# Altium schematic sheet 01-TABLE OF CONTENTS.SchDoc
size 513 x 386 mm
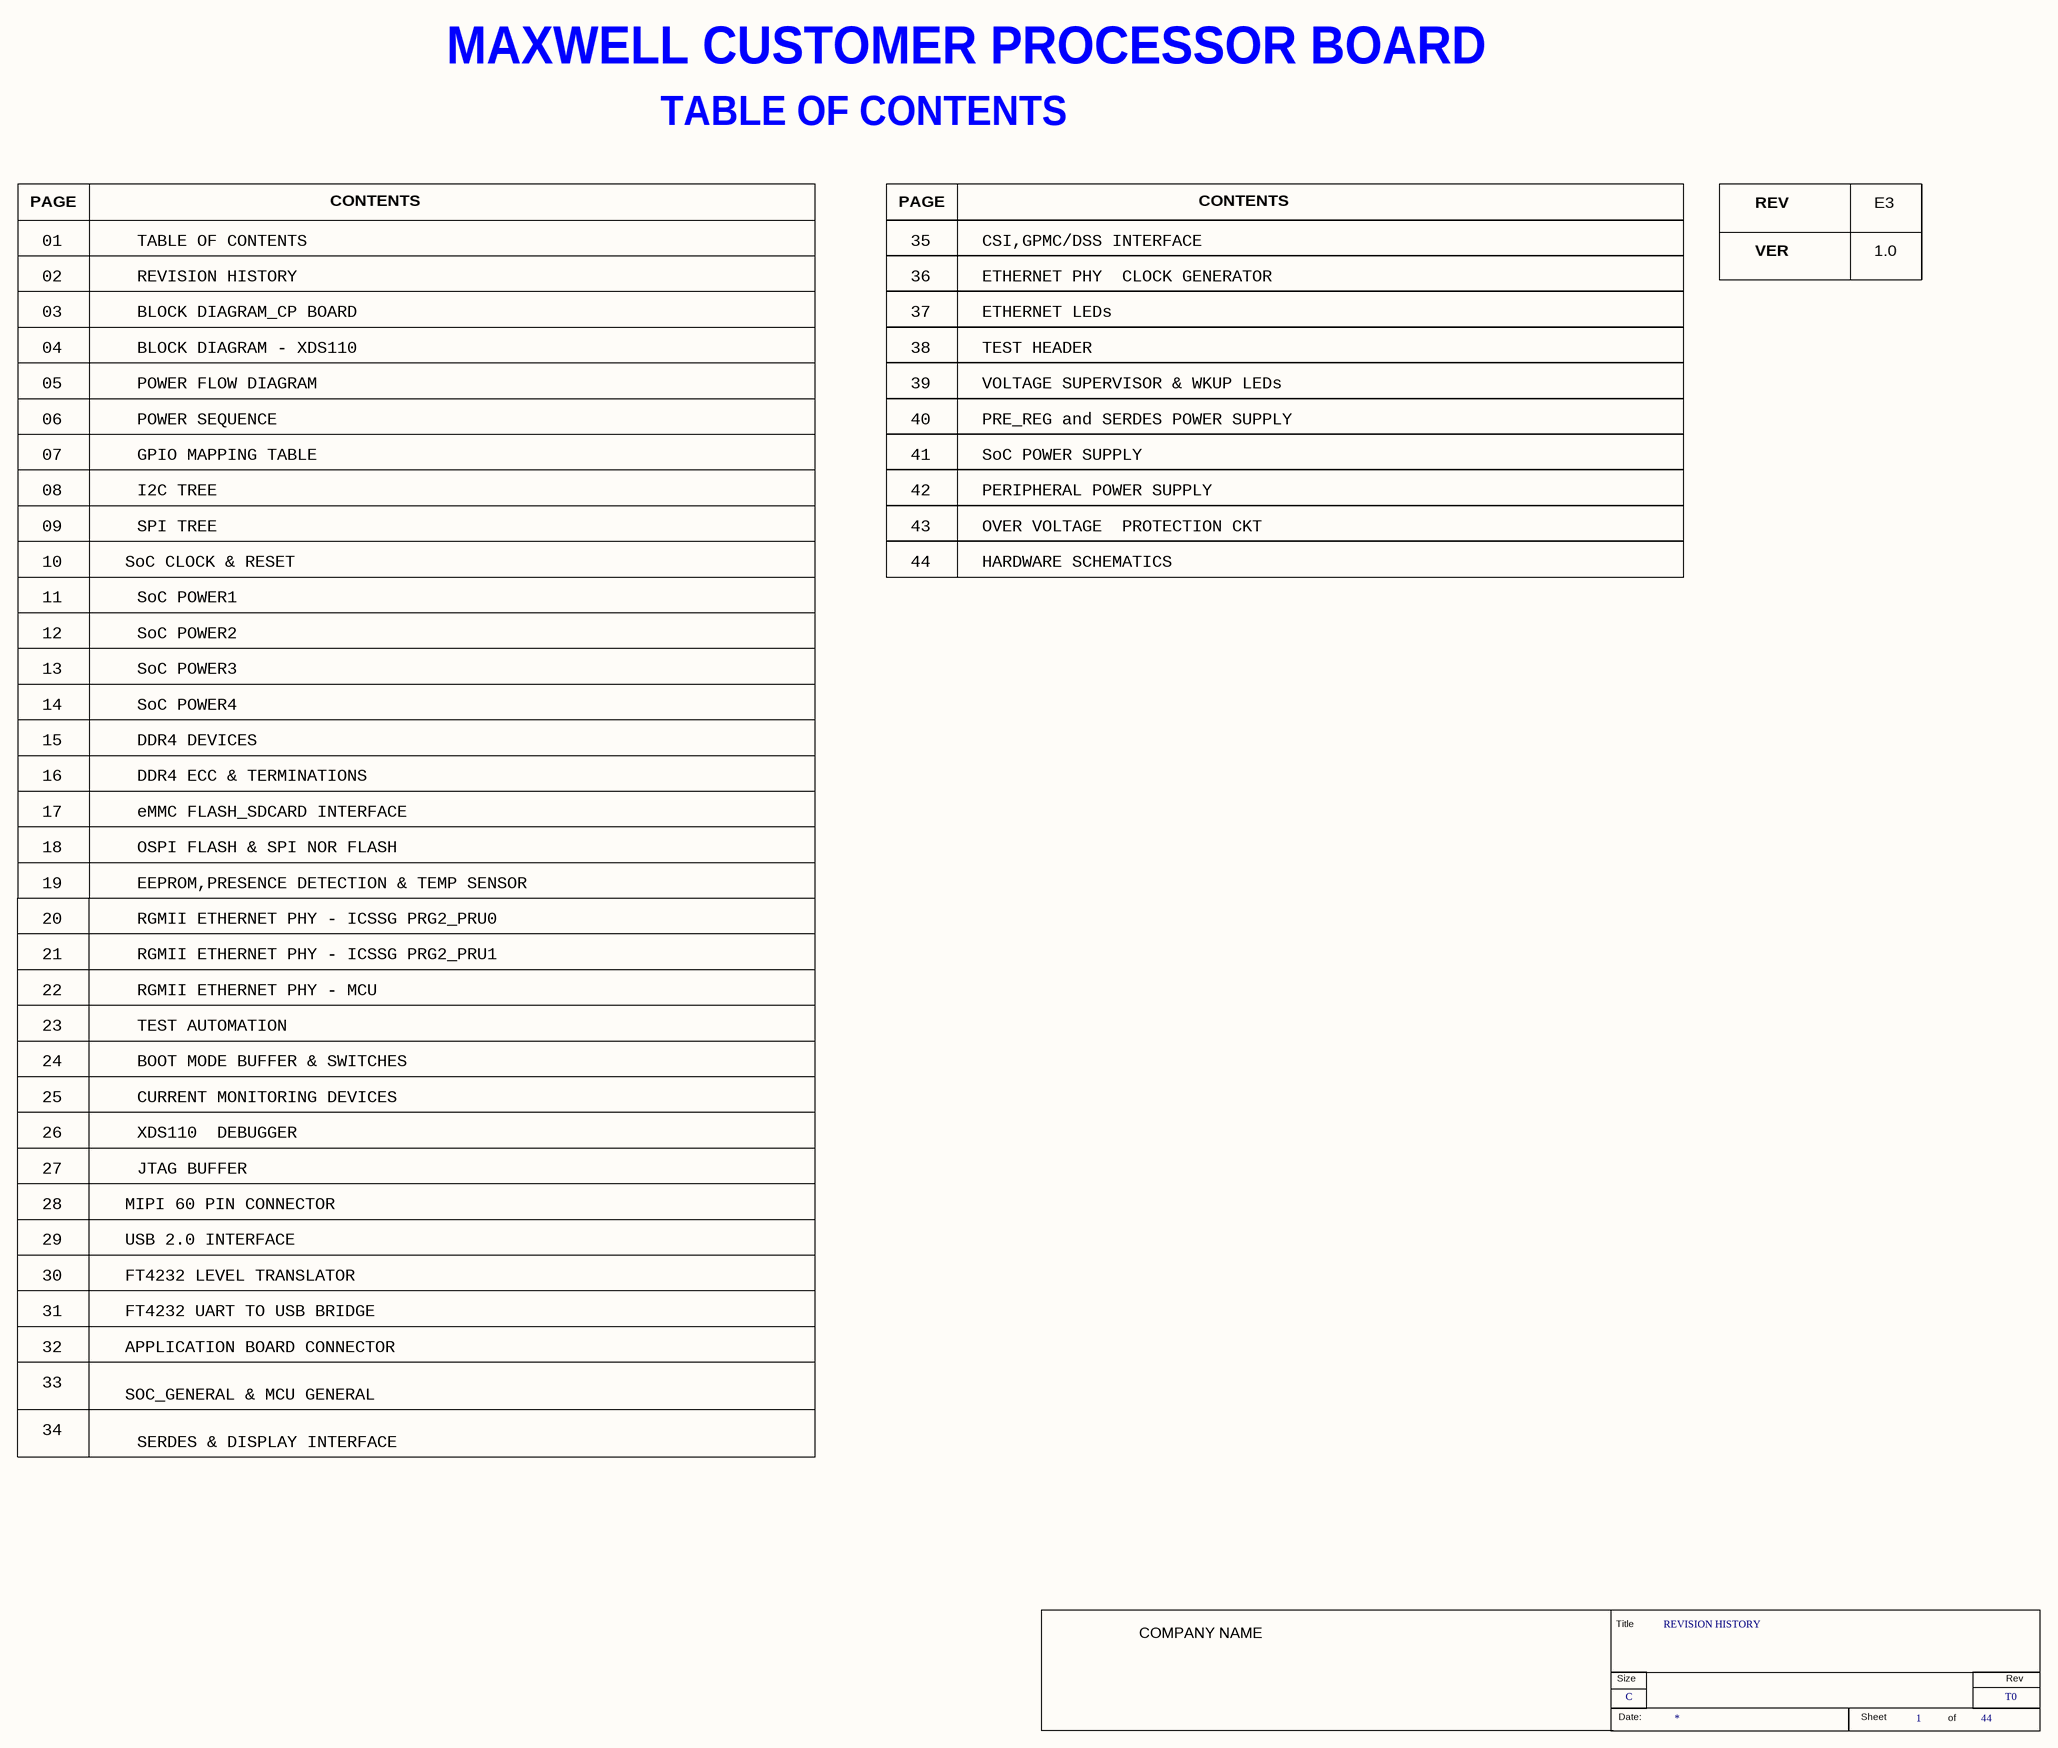
[diagram p0: 01-TABLE OF CONTENTS.SchDoc]

## Parts
*  RevCode: T0  Title: REVISION HISTORY  Page Size: C  Page Number: 1  Page Count: 44  (hidden comment: TRAINING_TITLEBLK_CSIZE)  (graphical)

## Notes on the sheet
- MAXWELL CUSTOMER PROCESSOR BOARD
- TABLE OF CONTENTS
- PAGE
- CONTENTS
- REV
- E3
- 01
- 35
- CSI,GPMC/DSS INTERFACE
- VER
- 1.0
- 02
- 03
- REVISION HISTORY
- BLOCK DIAGRAM_CP BOARD
- 36
- 37
- ETHERNET PHY  CLOCK GENERATOR
- ETHERNET LEDs
- 04
- 05
- BLOCK DIAGRAM - XDS110
- POWER FLOW DIAGRAM
- 38
- 39
- TEST HEADER
- VOLTAGE SUPERVISOR & WKUP LEDs
- 06
- POWER SEQUENCE
- 40
- PRE_REG and SERDES POWER SUPPLY
- 07
- 08
- I2C TREE
- GPIO MAPPING TABLE
- 41
- 42
- SoC POWER SUPPLY
- PERIPHERAL POWER SUPPLY
- 09
- 10
- SoC CLOCK & RESET
- SPI TREE
- 43
- 44
- OVER VOLTAGE  PROTECTION CKT
- HARDWARE SCHEMATICS
- 11
- SoC POWER1
- 12
- 13
- SoC POWER3
- SoC POWER2
- 14
- 15
- DDR4 DEVICES
- SoC POWER4
- 16
- DDR4 ECC & TERMINATIONS
- 17
- 18
- eMMC FLASH_SDCARD INTERFACE
- OSPI FLASH & SPI NOR FLASH
- 20
- 19
- RGMII ETHERNET PHY - ICSSG PRG2_PRU0
- EEPROM,PRESENCE DETECTION & TEMP SENSOR
- 21
- RGMII ETHERNET PHY - ICSSG PRG2_PRU1
- 22
- 23
- TEST AUTOMATION
- RGMII ETHERNET PHY - MCU
- 24
- 25
- BOOT MODE BUFFER & SWITCHES
- CURRENT MONITORING DEVICES
- 26
- XDS110  DEBUGGER
- 27
- 28
- MIPI 60 PIN CONNECTOR
- JTAG BUFFER
- 29
- 30
- FT4232 LEVEL TRANSLATOR
- USB 2.0 INTERFACE
- 31
- FT4232 UART TO USB BRIDGE
- 32
- 33
- APPLICATION BOARD CONNECTOR
- SOC_GENERAL & MCU GENERAL
- 34
- SERDES & DISPLAY INTERFACE
- (in symbol TRAINING_TITLEBLK_CSIZE) Title; COMPANY NAME; Size; Rev; Date:; Sheet; of

## Library data of the parts
* = TRAINING_TITLEBLK_CSIZE: Issue: 1.0; Page Create Date: Jan  8, 2022; Page Modify Date: *